# EAGLE schematic Controller3 (EAGLE 7.5.0)
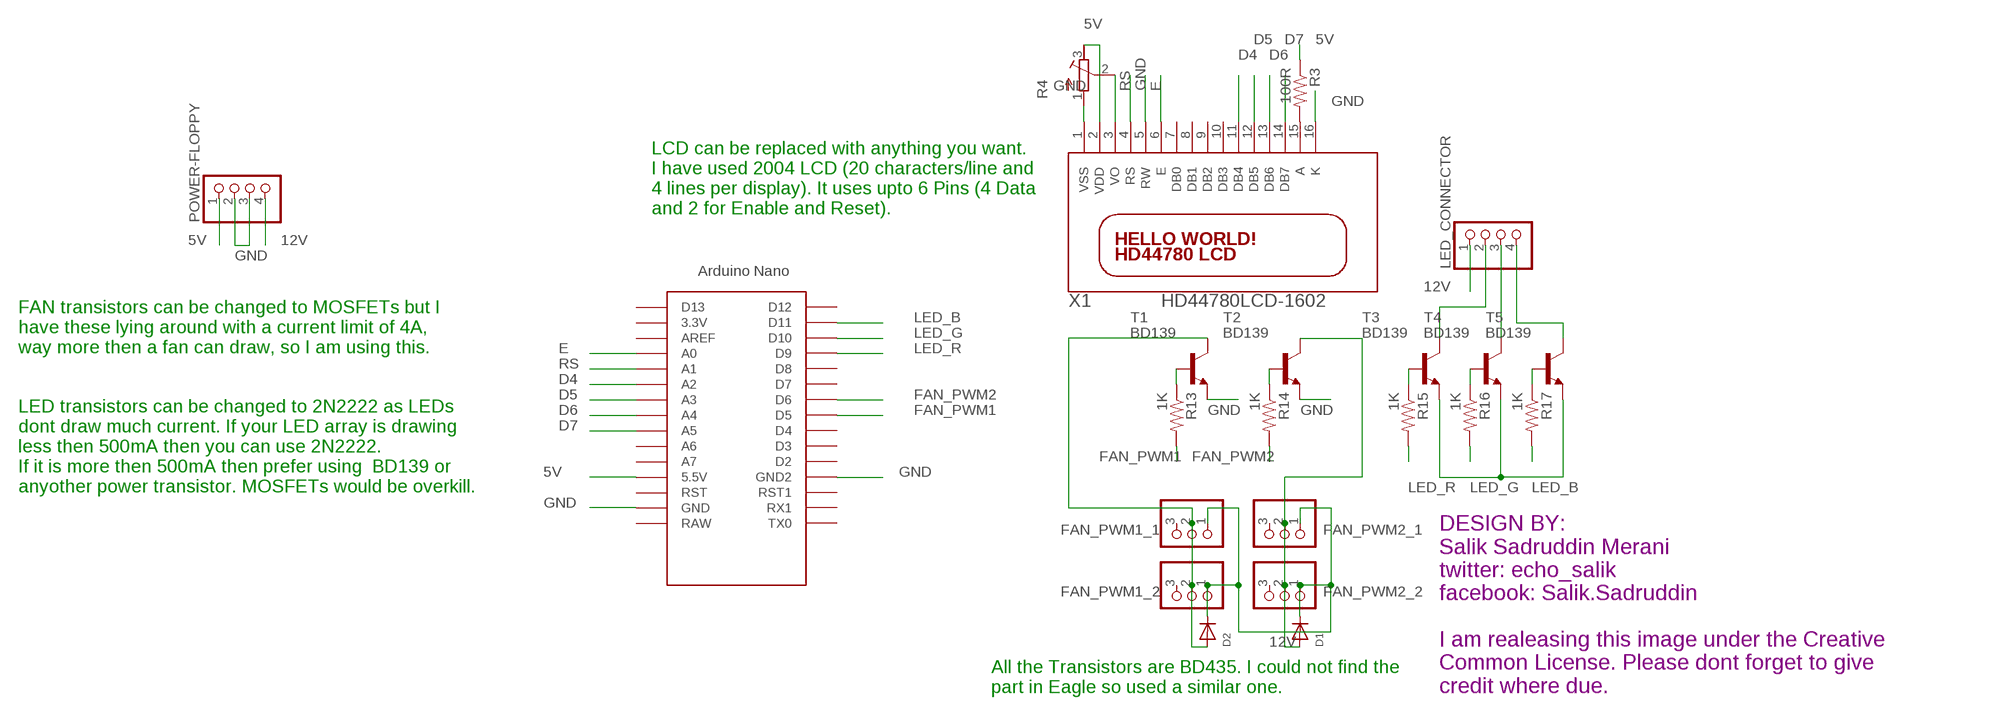
[diagram p0: schematic, sheet 1]

## Parts
D1  DIODEDO-1N4148  [DO-1N4148]
D2  DIODEDO-1N4148  [DO-1N4148]
FAN_PWM1_1  PINHD-1X3  [1X03]
FAN_PWM1_2  PINHD-1X3  [1X03]
FAN_PWM2_1  PINHD-1X3  [1X03]
FAN_PWM2_2  PINHD-1X3  [1X03]
LED_CONNECTOR  PINHD-1X4  [1X04]
POWER-FLOPPY  PINHD-1X4  [1X04]
R3  100R  R-US_0207/10  [0207/10]
R4  R-TRIMM3339P  [RTRIM3339P]
R13  1K  R-US_0207/10  [0207/10]
R14  1K  R-US_0207/10  [0207/10]
R15  1K  R-US_0207/10  [0207/10]
R16  1K  R-US_0207/10  [0207/10]
R17  1K  R-US_0207/10  [0207/10]
T1  BD139  [TO126]
T2  BD139  [TO126]
T3  BD139  [TO126]
T4  BD139  [TO126]
T5  BD139  [TO126]
U$1  NANO  [NANO]
X1  HD44780LCD-1602  [LCD1602]

## Nets
5V: POWER-FLOPPY.1 R3.1 R4.3(E) U$1.5V(5.5V) X1.2(VDD)
12V: D1.C D2.C FAN_PWM1_1.1 FAN_PWM1_2.1 FAN_PWM2_1.1 FAN_PWM2_2.1 LED_CONNECTOR.1 POWER-FLOPPY.4
D4: U$1.A2 X1.11(DB4)
D5: U$1.A3 X1.12(DB5)
D6: U$1.A4 X1.13(DB6)
D7: U$1.A5 X1.14(DB7)
E: X1.6(E)
FAN_PWM1: R13.2 U$1.D5
FAN_PWM2: R14.2 U$1.D6
GND: POWER-FLOPPY.2 POWER-FLOPPY.3 R4.1(A) T1.1(E) T2.1(E) U$1.GND U$1.GND1(GND2) X1.1(VSS) X1.5(RW) X1.16(K)
LED_B: R17.2 U$1.D11
LED_G: R16.2 U$1.D10
LED_R: R15.2 U$1.D9
N$4: R3.2 X1.15(A)
N$6: R4.2(S) X1.3(VO)
N$9: R13.1 T1.3(B)
N$10: R14.1 T2.3(B)
N$11: R15.1 T3.3(B)
N$12: R16.1 T4.3(B)
N$15: R17.1 T5.3(B)
N$18: T3.1(E) T4.1(E) T5.1(E)
N$19: D2.A FAN_PWM1_1.2 FAN_PWM1_2.2 T1.2(C)
N$22: LED_CONNECTOR.2 T3.2(C)
N$23: LED_CONNECTOR.3 T4.2(C)
N$24: LED_CONNECTOR.4 T5.2(C)
N$26: D1.A FAN_PWM2_1.2 FAN_PWM2_2.2 T2.2(C)
RS: X1.4(RS)
Unconnected: FAN_PWM1_1.3 FAN_PWM1_2.3 FAN_PWM2_1.3 FAN_PWM2_2.3 U$1.3.3V U$1.A0 U$1.A1 U$1.A6 U$1.A7 U$1.AREF U$1.D2 U$1.D3 U$1.D4 U$1.D7 U$1.D8 U$1.D12 U$1.D13 U$1.ICSP1 U$1.ICSP2 U$1.ICSP3 U$1.ICSP4 U$1.ICSP5 U$1.ICSP6 U$1.RAW U$1.RST U$1.RST1 U$1.RX1 U$1.TX0 X1.7(DB0) X1.8(DB1) X1.9(DB2) X1.10(DB3)

## Notes on the sheet
- LCD can be replaced with anything you want.
  I have used 2004 LCD (20 characters/line and
  4 lines per display). It uses upto 6 Pins (4 Data
  and 2 for Enable and Reset).
- FAN transistors can be changed to MOSFETs but I
  have these lying around with a current limit of 4A,
  way more then a fan can draw, so I am using this.
- LED transistors can be changed to 2N2222 as LEDs
  dont draw much current. If your LED array is drawing
  less then 500mA then you can use 2N2222.
  If it is more then 500mA then prefer using  BD139 or
  anyother power transistor. MOSFETs would be overkill.
- All the Transistors are BD435. I could not find the
  part in Eagle so used a similar one.
- DESIGN BY:
  Salik Sadruddin Merani
  twitter: echo_salik
  facebook: Salik.Sadruddin
  
  I am realeasing this image under the Creative
  Common License. Please dont forget to give 
  credit where due.

## Library data of the parts
D1 D2 = adafruit:DIODE: Diode SMADIODE - SMA Surface Mount Package 20V 1A Schottky Diode Digikey: 641-1014-6-ND DO-1N4148 - Through Hole Small Current Diode SOD-123 20V 1 A (.5mV Vf) Schottky Diode - Digikey: MBRX120TPMSCT-ND SOD-323 10V 570mA (.38mV Vf, 3ns) Schottky Diode - Digikey: ZLLS410CT-ND SOD-523 30V 30mA Schottky Diode (RB751S-40TE61) - Digikey: RB751S-40TE61CT-ND SOT23-R/W - SOT23 Package (R = Solder Paste/Reflow Ovens, W = Hand-Soldering) BAT54Film 40V 300mA - Digikey: 497-7162-1-ND
FAN_PWM1_1 FAN_PWM1_2 FAN_PWM2_1 FAN_PWM2_2 = pinhead:PINHD-1X3: PIN HEADER
LED_CONNECTOR POWER-FLOPPY = pinhead:PINHD-1X4: PIN HEADER
R3 R13-R17 = adafruit:R-US_: RESISTOR, American symbol
R4 = resistor:R-TRIMM: Trimm resistor
T1-T5 = transistor:BD139: NPN TRANSISTOR
U$1 = Arduino-clone:NANO: Arduino Nano
X1 = adafruit:HD44780LCD: HD44780 LCD Standard character type LCDs, available in sizes from 8x1 to 40x4!